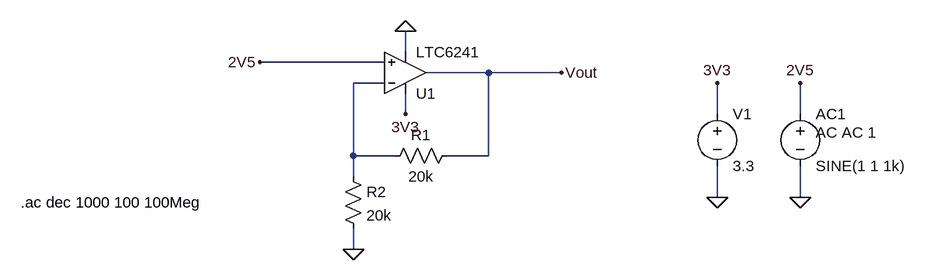
[diagram p0: schematic inverting_opamp.asc]
inverting_opamp.asc, the LTspice schematic file:
Version 4
SHEET 1 880 680
WIRE 80 -16 80 -48
WIRE 48 0 -144 0
WIRE 208 16 112 16
WIRE 320 16 208 16
WIRE 48 32 0 32
WIRE 80 80 80 48
WIRE 560 80 560 32
WIRE 688 80 688 32
WIRE 0 144 0 32
WIRE 64 144 0 144
WIRE 208 144 208 16
WIRE 208 144 144 144
WIRE 0 176 0 144
WIRE 560 208 560 160
WIRE 688 208 688 160
WIRE 0 288 0 256
FLAG 80 -48 0
FLAG 560 32 3V3
FLAG 688 32 2V5
FLAG 688 208 0
FLAG 560 208 0
FLAG 80 80 3V3
FLAG -144 0 2V5
FLAG 320 16 Vout
FLAG 0 288 0
SYMBOL voltage 688 64 R0
WINDOW 123 24 44 Left 2
WINDOW 39 0 0 Left 0
SYMATTR Value2 AC AC 1
SYMATTR InstName AC1
SYMATTR Value SINE(1 1 1k)
SYMBOL voltage 560 64 R0
WINDOW 123 0 0 Left 0
WINDOW 39 0 0 Left 0
SYMATTR InstName V1
SYMATTR Value 3.3
SYMBOL OpAmps\\LTC6241 80 16 M180
SYMATTR InstName U1
SYMBOL res 48 160 R270
WINDOW 0 32 56 VTop 2
WINDOW 3 0 56 VBottom 2
SYMATTR InstName R1
SYMATTR Value 20k
SYMBOL res -16 160 R0
SYMATTR InstName R2
SYMATTR Value 20k
TEXT -512 216 Left 2 !.ac dec 1000 100 100Meg

The netlist it stands for:
* inverting_opamp.asc
V§AC1 2V5 0 SINE(1 1 1k) AC AC 1
V1 3V3 0 3.3
XU1 2V5 N001 3V3 0 Vout LTC6241  ; pins In+ In- V+ V- OUT
R1 N001 Vout 20k
R2 N001 0 20k
.ac dec 1000 100 100Meg
.lib LTC4.lib
.backanno
.end